# Altium project RX_FM.PrjPCB
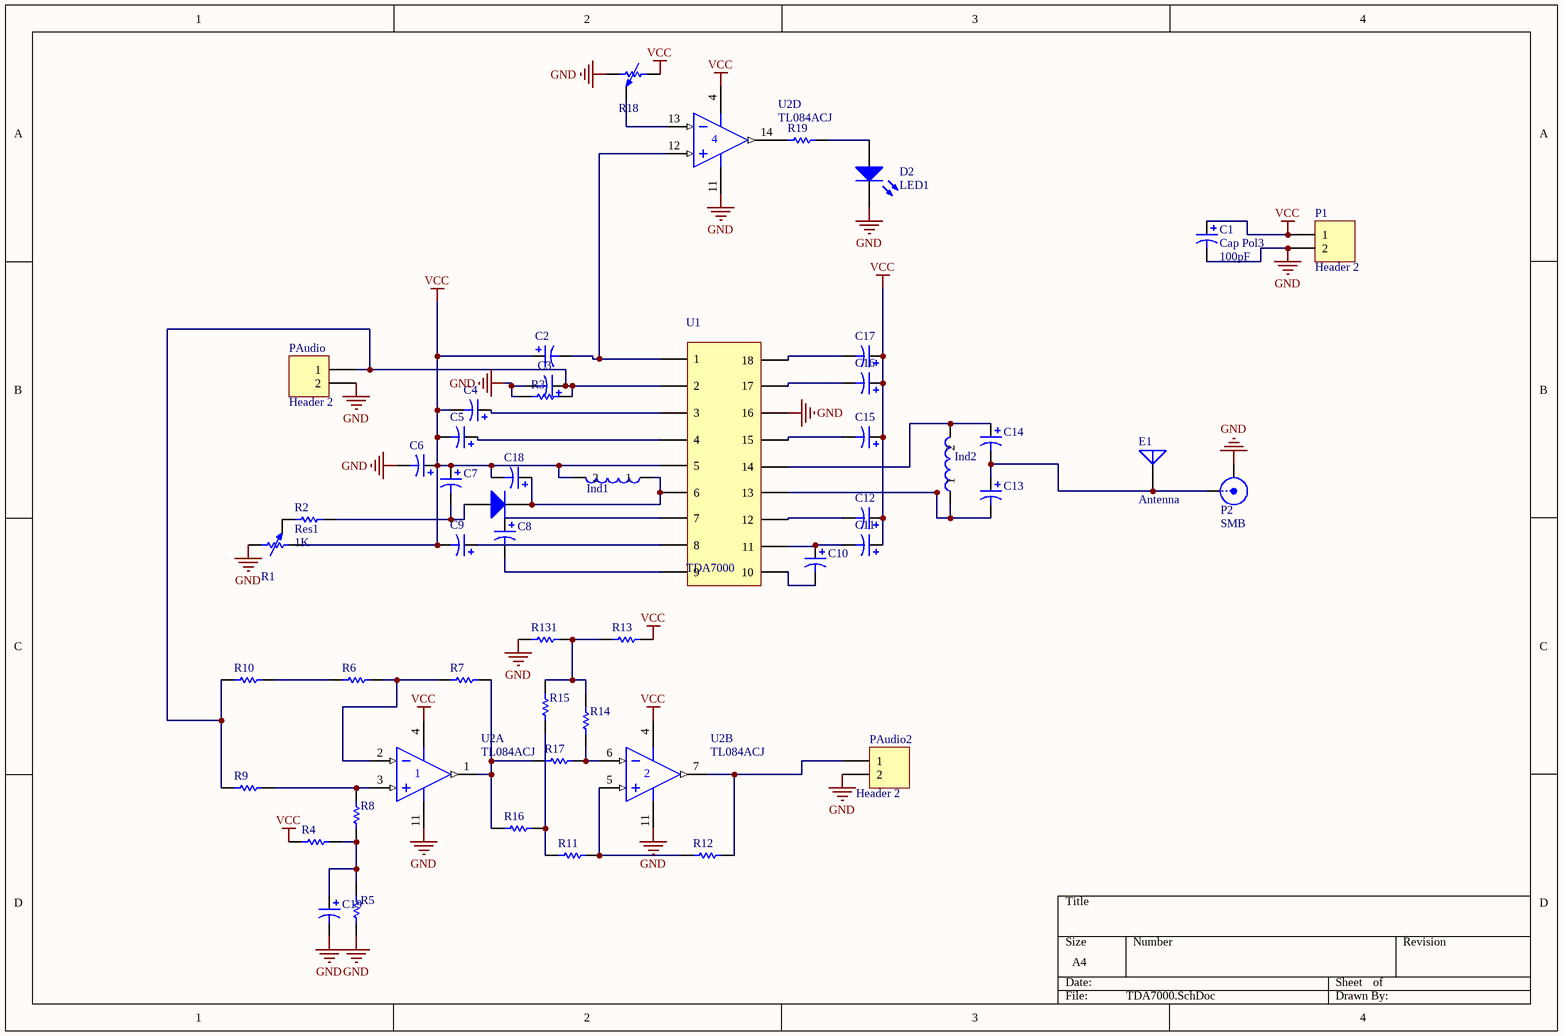
[diagram p0: TDA7000.SchDoc]
1 sheet, 50 parts. Net scope: global (net labels, ports and power ports of the same name join across sheets).
Board files: TDA7000v2.PcbDoc, TDA7000.PcbDoc

## Sheet TDA7000.SchDoc
size A4

### Parts
C1  Cap Pol3  value 100pF  [C0805]
C2  Cap Pol3  [C0805]  (value not drawn)
C3  Cap Pol3  [C0805]  (value not drawn)
C4  Cap Pol3  [C0805]  (value not drawn)
C5  Cap Pol3  [C0805]  (value not drawn)
C6  Cap Pol3  [C0805]  (value not drawn)
C7  Cap Pol3  [C0805]  (value not drawn)
C8  Cap Pol3  [C0805]  (value not drawn)
C9  Cap Pol3  [C0805]  (value not drawn)
C10  Cap Pol3  [C0805]  (value not drawn)
C11  Cap Pol3  [C0805]  (value not drawn)
C12  Cap Pol3  [C0805]  (value not drawn)
C13  Cap Pol3  [C0805]  (value not drawn)
C14  Cap Pol3  [C0805]  (value not drawn)
C15  Cap Pol3  [C0805]  (value not drawn)
C16  Cap Pol3  [C0805]  (value not drawn)
C17  Cap Pol3  [C0805]  (value not drawn)
C18  Cap Pol3  [C0805]  (value not drawn)
C19  Cap Pol3  [C0805]  (value not drawn)
D1  Diode 1N914  [DO-35]  (value not drawn)
D2  LED1  [LED-1]
E1  Antenna  [PIN1]
Ind1  Ind2  [Ind_3mm]  (value not drawn)
Ind2  Ind2  [Ind_3mm]  (value not drawn)
P1  Header 2  [HDR1X2]
P2  SMB  [SMB_V-RJ45]
PAudio  Header 2  [HDR1X2]
PAudio2  Header 2  [HDR1X2]
R1  Pot  [Potenciometro]  (value not drawn)
R2  Res1  value 1K  [AXIAL-0.3]
R3  Res Semi  [2012[0805]]  (value not drawn)
R4  Res Semi  [2012[0805]]  (value not drawn)
R5  Res Semi  [2012[0805]]  (value not drawn)
R6  Res Semi  [2012[0805]]  (value not drawn)
R7  Res Semi  [2012[0805]]  (value not drawn)
R8  Res Semi  [2012[0805]]  (value not drawn)
R9  Res Semi  [2012[0805]]  (value not drawn)
R10  Res Semi  [2012[0805]]  (value not drawn)
R11  Res Semi  [2012[0805]]  (value not drawn)
R12  Res Semi  [2012[0805]]  (value not drawn)
R13  Res Semi  [2012[0805]]  (value not drawn)
R14  Res Semi  [2012[0805]]  (value not drawn)
R15  Res Semi  [2012[0805]]  (value not drawn)
R16  Res Semi  [2012[0805]]  (value not drawn)
R17  Res Semi  [2012[0805]]  (value not drawn)
R18  Pot  [Potenciometro]  (value not drawn)
R19  Res Semi  [2012[0805]]  (value not drawn)
R131  Res Semi  [2012[0805]]  (value not drawn)
U1  TDA7000  [TDA7000]
U2  TL084ACJ  [632-08]  (parts A,B,D of 4)

### Nets
GND: C1.2 C3.2 C6.2 C19.2 D2.2(K) P1.2 P2.2(Y) PAudio.2 PAudio2.2 R1.1 R3.1 R5.1 R18.2 R131.2 U1.16 U2.11(V-)
VCC: C1.1 C2.1 C4.2 C5.2 C6.1 C7.1 C9.2 C11.1 C12.1 C15.1 C16.1 C17.1 C18.2 Ind1.2 P1.1 R1.2 R4.1 R13.1 R18.1 U1.5 U2.4(V+)
NetC2_2: C2.2 U1.1 U2.12(IN+)
NetC3_1: C3.1 PAudio.1 R3.2 R9.2 R10.2 U1.2
NetC4_1: C4.1 U1.3
NetC5_1: C5.1 U1.4
NetC7_2: C7.2 D1.1(A) R2.2
NetC8_1: C8.1 U1.7
NetC8_2: C8.2 U1.9
NetC9_1: C9.1 U1.8
NetC10_1: C10.1 C11.2 U1.11
NetC10_2: C10.2 U1.10
NetC12_2: C12.2 U1.12
NetC13_1: C13.1 C14.2 E1.1(A) P2.1(X)
NetC13_2: C13.2 Ind2.1 U1.13
NetC14_1: C14.1 Ind2.2 U1.14
NetC15_2: C15.2 U1.15
NetC16_2: C16.2 U1.17
NetC17_2: C17.2 U1.18
NetC18_1: C18.1 D1.2(K) Ind1.1 U1.6
NetC19_1: C19.1 R4.2 R5.2 R8.1
NetD2_1: D2.1(A) R19.2
NetPAudio2_1: PAudio2.1 R12.1 U2.7(OUT)
NetR1_3: R1.3 R2.1
NetR6_1: R6.1 R7.2 U2.2(IN-)
NetR6_2: R6.2 R10.1
NetR7_1: R7.1 R16.1 R17.1 U2.1(OUT)
NetR8_2: R8.2 R9.1 U2.3(IN+)
NetR11_1: R11.1 R12.2 U2.5(IN+)
NetR11_2: R11.2 R15.2 R16.2
NetR13_2: R13.2 R14.1 R15.1 R131.1
NetR14_2: R14.2 R17.2 U2.6(IN-)
NetR18_3: R18.3 U2.13(IN-)
NetR19_1: R19.1 U2.14(OUT)

### Library data of the parts
C1 = Cap Pol3: Polarized Capacitor (Surface Mount); Published: 8-Jun-2000; LatestRevisionDate: 17-Jul-2002; LatestRevisionNote: Re-released for DXP Platform.; PackageReference: C0805; Publisher: Altium Limited
C2-C19 = Cap Pol3: Polarized Capacitor (Surface Mount); Value: 100pF; Published: 8-Jun-2000; LatestRevisionDate: 17-Jul-2002; LatestRevisionNote: Re-released for DXP Platform.; PackageReference: C0805; Publisher: Altium Limited
D1 = Diode 1N914: High Conductance Fast Diode; Published: 8-Jun-2000; LatestRevisionDate: 17-Jul-2002; LatestRevisionNote: Re-released for DXP Platform.; DatasheetDocument: 1997; PackageReference: DO-35; Publisher: Altium Limited; Code_JEDEC: DO-204-AH; ComponentLink1Description: Manufacturer Link; ComponentLink1URL: http://www.fairchildsemi.com/; ComponentLink2Description: Datasheet; ComponentLink2URL: http://www.fairchildsemi.com/ds/1N%2F1N4448.pdf
D2 = LED1: Typical RED GaAs LED; Published: 8-Jun-2000; LatestRevisionDate: 08-Jul-2005; LatestRevisionNote: Mech Layer 1 removed.; PackageReference: LED-1; Publisher: Altium Limited
E1 = Antenna: Generic Antenna; Published: 24-Mar-1999; LatestRevisionDate: 17-Jul-2002; LatestRevisionNote: Re-released for DXP Platform.; PackageReference: PIN1; Publisher: Altium Limited
P1 PAudio PAudio2 = Header 2: Header, 2-Pin; LatestRevisionDate: 17-Jul-2002; LatestRevisionNote: Re-released for DXP Platform.; Publisher: Altium Limited
P2 = SMB: SMB Straight Connector; LatestRevisionDate: 17-Jul-2002; LatestRevisionNote: Re-released for DXP Platform.; Publisher: Altium Limited
R2 = Res1: Resistor; Published: 8-Jun-2000; LatestRevisionDate: 17-Jul-2002; LatestRevisionNote: Re-released for DXP Platform.; PackageReference: AXIAL-0.3; Publisher: Altium Limited
R3-R17 R19 R131 = Res Semi: Semiconductor Resistor; Value: 1K; Published: 8-Jun-2000; LatestRevisionDate: 17-Jul-2002; LatestRevisionNote: Re-released for DXP Platform.; PackageReference: AXIAL-0.5; Publisher: Altium Limited
U2 = TL084ACJ: JFET-Input Operational Amplifier; Published: 17-Jul-2002; LatestRevisionDate: 06-Jun-2005; LatestRevisionNote: Stylized 3D Model Added.; DatasheetDocument: 1988; PackageReference: 632-08; Publisher: Altium Limited; ComponentLink1Description: Manufacturer Link; ComponentLink1URL: http://www.onsemi.com/site/products/parametrics/0,4446,251,00.html